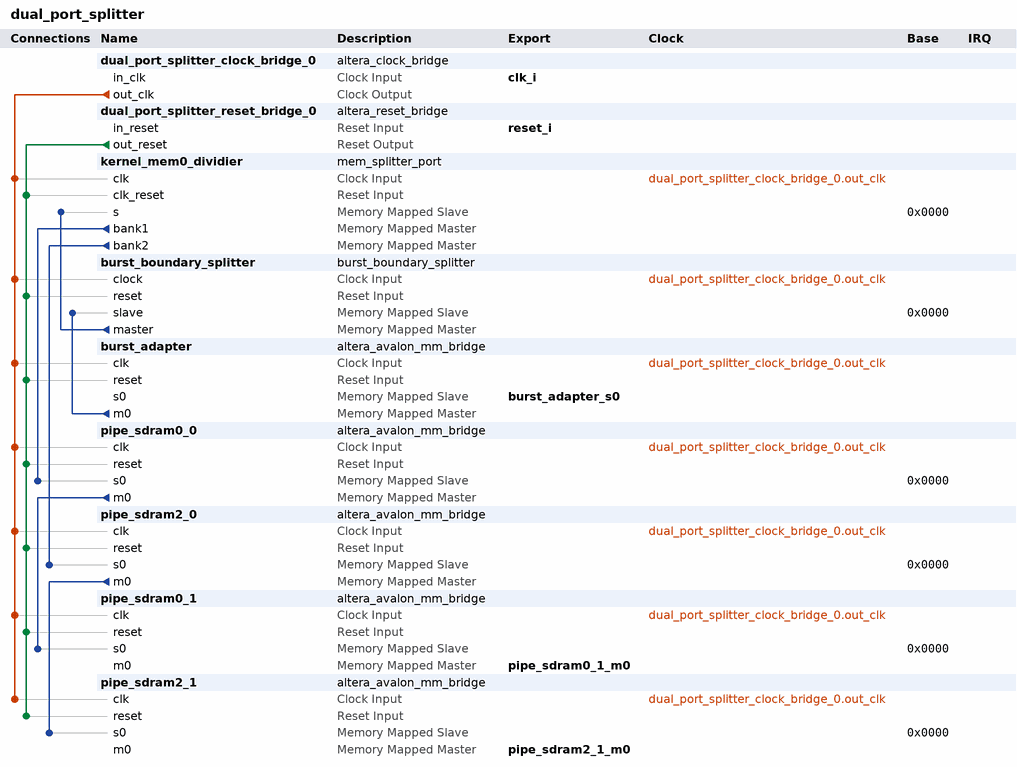
[diagram p0: system contents]
# Platform Designer (Qsys) system dual_port_splitter, Arria 10 10AS066N3F40E2SG
# Parameters at their usual value, and those the tool derives, are not listed.
package require -exact qsys 1.0
create_system dual_port_splitter
set_project_property DEVICE_FAMILY {Arria 10}
set_project_property DEVICE 10AS066N3F40E2SG

add_component dual_port_splitter_clock_bridge_0 ip/dual_port_splitter/dual_port_splitter_clock_bridge_0.ip altera_clock_bridge dual_port_splitter_clock_bridge_0 17.1
load_component dual_port_splitter_clock_bridge_0
set_component_parameter_value DERIVED_CLOCK_RATE 250000000
set_component_parameter_value EXPLICIT_CLOCK_RATE 0
save_component

add_component dual_port_splitter_reset_bridge_0 ip/dual_port_splitter/dual_port_splitter_reset_bridge_0.ip altera_reset_bridge dual_port_splitter_reset_bridge_0 17.1
load_component dual_port_splitter_reset_bridge_0
set_component_parameter_value ACTIVE_LOW_RESET 0
set_component_parameter_value SYNCHRONOUS_EDGES none
save_component

add_component kernel_mem0_dividier ip/board/board_mem_splitter_port_0.ip mem_splitter_port kernel_mem0_dividier 16.0

add_component burst_boundary_splitter ip/board/board_burst_boundary_splitter_0.ip burst_boundary_splitter burst_boundary_splitter 1.0

add_component burst_adapter ip/board/board_mm_bridge_0.ip altera_avalon_mm_bridge burst_adapter 17.1

add_component pipe_sdram0_0 ip/board/board_mm_bridge_1.ip altera_avalon_mm_bridge pipe_sdram0_0 17.1

add_component pipe_sdram2_0 ip/board/board_mm_bridge_1.ip altera_avalon_mm_bridge pipe_sdram2_0 17.1

add_component pipe_sdram0_1 ip/board/board_mm_bridge_3.ip altera_avalon_mm_bridge pipe_sdram0_1 17.1

add_component pipe_sdram2_1 ip/board/board_mm_bridge_3.ip altera_avalon_mm_bridge pipe_sdram2_1 17.1

# connections
add_connection dual_port_splitter_clock_bridge_0.out_clk burst_adapter.clk clock
add_connection dual_port_splitter_clock_bridge_0.out_clk burst_boundary_splitter.clock clock
add_connection dual_port_splitter_clock_bridge_0.out_clk kernel_mem0_dividier.clk clock
add_connection dual_port_splitter_clock_bridge_0.out_clk pipe_sdram0_0.clk clock
add_connection dual_port_splitter_clock_bridge_0.out_clk pipe_sdram0_1.clk clock
add_connection dual_port_splitter_clock_bridge_0.out_clk pipe_sdram2_0.clk clock
add_connection dual_port_splitter_clock_bridge_0.out_clk pipe_sdram2_1.clk clock
add_connection dual_port_splitter_reset_bridge_0.out_reset burst_adapter.reset reset
add_connection dual_port_splitter_reset_bridge_0.out_reset burst_boundary_splitter.reset reset
add_connection dual_port_splitter_reset_bridge_0.out_reset kernel_mem0_dividier.clk_reset reset
add_connection dual_port_splitter_reset_bridge_0.out_reset pipe_sdram0_0.reset reset
add_connection dual_port_splitter_reset_bridge_0.out_reset pipe_sdram0_1.reset reset
add_connection dual_port_splitter_reset_bridge_0.out_reset pipe_sdram2_0.reset reset
add_connection dual_port_splitter_reset_bridge_0.out_reset pipe_sdram2_1.reset reset
add_connection burst_adapter.m0 burst_boundary_splitter.slave avalon
set_connection_parameter_value burst_adapter.m0/burst_boundary_splitter.slave baseAddress 0x0000
add_connection burst_boundary_splitter.master kernel_mem0_dividier.s avalon
set_connection_parameter_value burst_boundary_splitter.master/kernel_mem0_dividier.s baseAddress 0x0000
add_connection kernel_mem0_dividier.bank1 pipe_sdram0_0.s0 avalon
set_connection_parameter_value kernel_mem0_dividier.bank1/pipe_sdram0_0.s0 baseAddress 0x0000
add_connection kernel_mem0_dividier.bank2 pipe_sdram2_0.s0 avalon
set_connection_parameter_value kernel_mem0_dividier.bank2/pipe_sdram2_0.s0 baseAddress 0x0000
add_connection pipe_sdram0_0.m0 pipe_sdram0_1.s0 avalon
set_connection_parameter_value pipe_sdram0_0.m0/pipe_sdram0_1.s0 baseAddress 0x0000
add_connection pipe_sdram2_0.m0 pipe_sdram2_1.s0 avalon
set_connection_parameter_value pipe_sdram2_0.m0/pipe_sdram2_1.s0 baseAddress 0x0000

# exported interfaces
add_interface burst_adapter_s0 avalon slave
set_interface_property burst_adapter_s0 EXPORT_OF burst_adapter.s0
add_interface clk_i clock sink
set_interface_property clk_i EXPORT_OF dual_port_splitter_clock_bridge_0.in_clk
add_interface pipe_sdram0_1_m0 avalon master
set_interface_property pipe_sdram0_1_m0 EXPORT_OF pipe_sdram0_1.m0
add_interface pipe_sdram2_1_m0 avalon master
set_interface_property pipe_sdram2_1_m0 EXPORT_OF pipe_sdram2_1.m0
add_interface reset_i reset sink
set_interface_property reset_i EXPORT_OF dual_port_splitter_reset_bridge_0.in_reset

set_interconnect_requirement {$system} qsys_mm.clockCrossingAdapter HANDSHAKE
set_interconnect_requirement {$system} qsys_mm.enableEccProtection FALSE
set_interconnect_requirement {$system} qsys_mm.insertDefaultSlave FALSE
set_interconnect_requirement {$system} qsys_mm.maxAdditionalLatency 1

save_system dual_port_splitter.qsys
